# EAGLE schematic stepper (EAGLE 7.6.0)
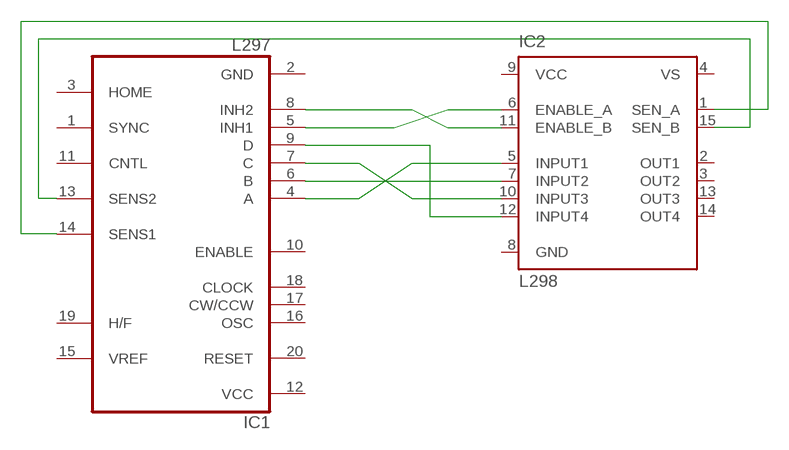
[diagram p0: schematic, sheet 1]

## Parts
IC1  L297  [DIL20]
IC2  L298  [MULTIWATT-15]

## Nets
N$1: IC1.4(A) IC2.5(INPUT1)
N$2: IC1.6(B) IC2.7(INPUT2)
N$3: IC1.7(C) IC2.10(INPUT3)
N$4: IC1.9(D) IC2.12(INPUT4)
N$5: IC1.5(INH1) IC2.6(ENABLE_A)
N$6: IC1.8(INH2) IC2.11(ENABLE_B)
N$7: IC1.14(SENS1) IC2.1(SEN_A)
N$8: IC1.13(SENS2) IC2.15(SEN_B)
Unconnected: IC1.1(SYNC) IC1.3(HOME) IC1.10(ENABLE) IC1.11(CNTL) IC1.15(VREF) IC1.16(OSC) IC1.17(CW/CCW) IC1.18(CLOCK) IC1.19(H/F) IC1.20(RESET) IC2.2(OUT1) IC2.3(OUT2) IC2.13(OUT3) IC2.14(OUT4)

## Power pins joined to a net without a drawn wire
GND: IC1.2(GND) IC2.8(GND)
VCC: IC1.12(VCC) IC2.9(VCC)
VS: IC2.4(VS)

## Library data of the parts
IC1 = st-microelectronics:L297: STEPPER MOTOR CONTROLLER; MPN: L297/1; OC_FARNELL: 1094209; OC_NEWARK: 56P8258
IC2 = st-microelectronics:L298: DUAL FULL-BRIDGE DRIVER; MPN: L298N; OC_FARNELL: 1589425; OC_NEWARK: 32M1527